# EAGLE design deflection_amplifier (EAGLE 9.6.2)
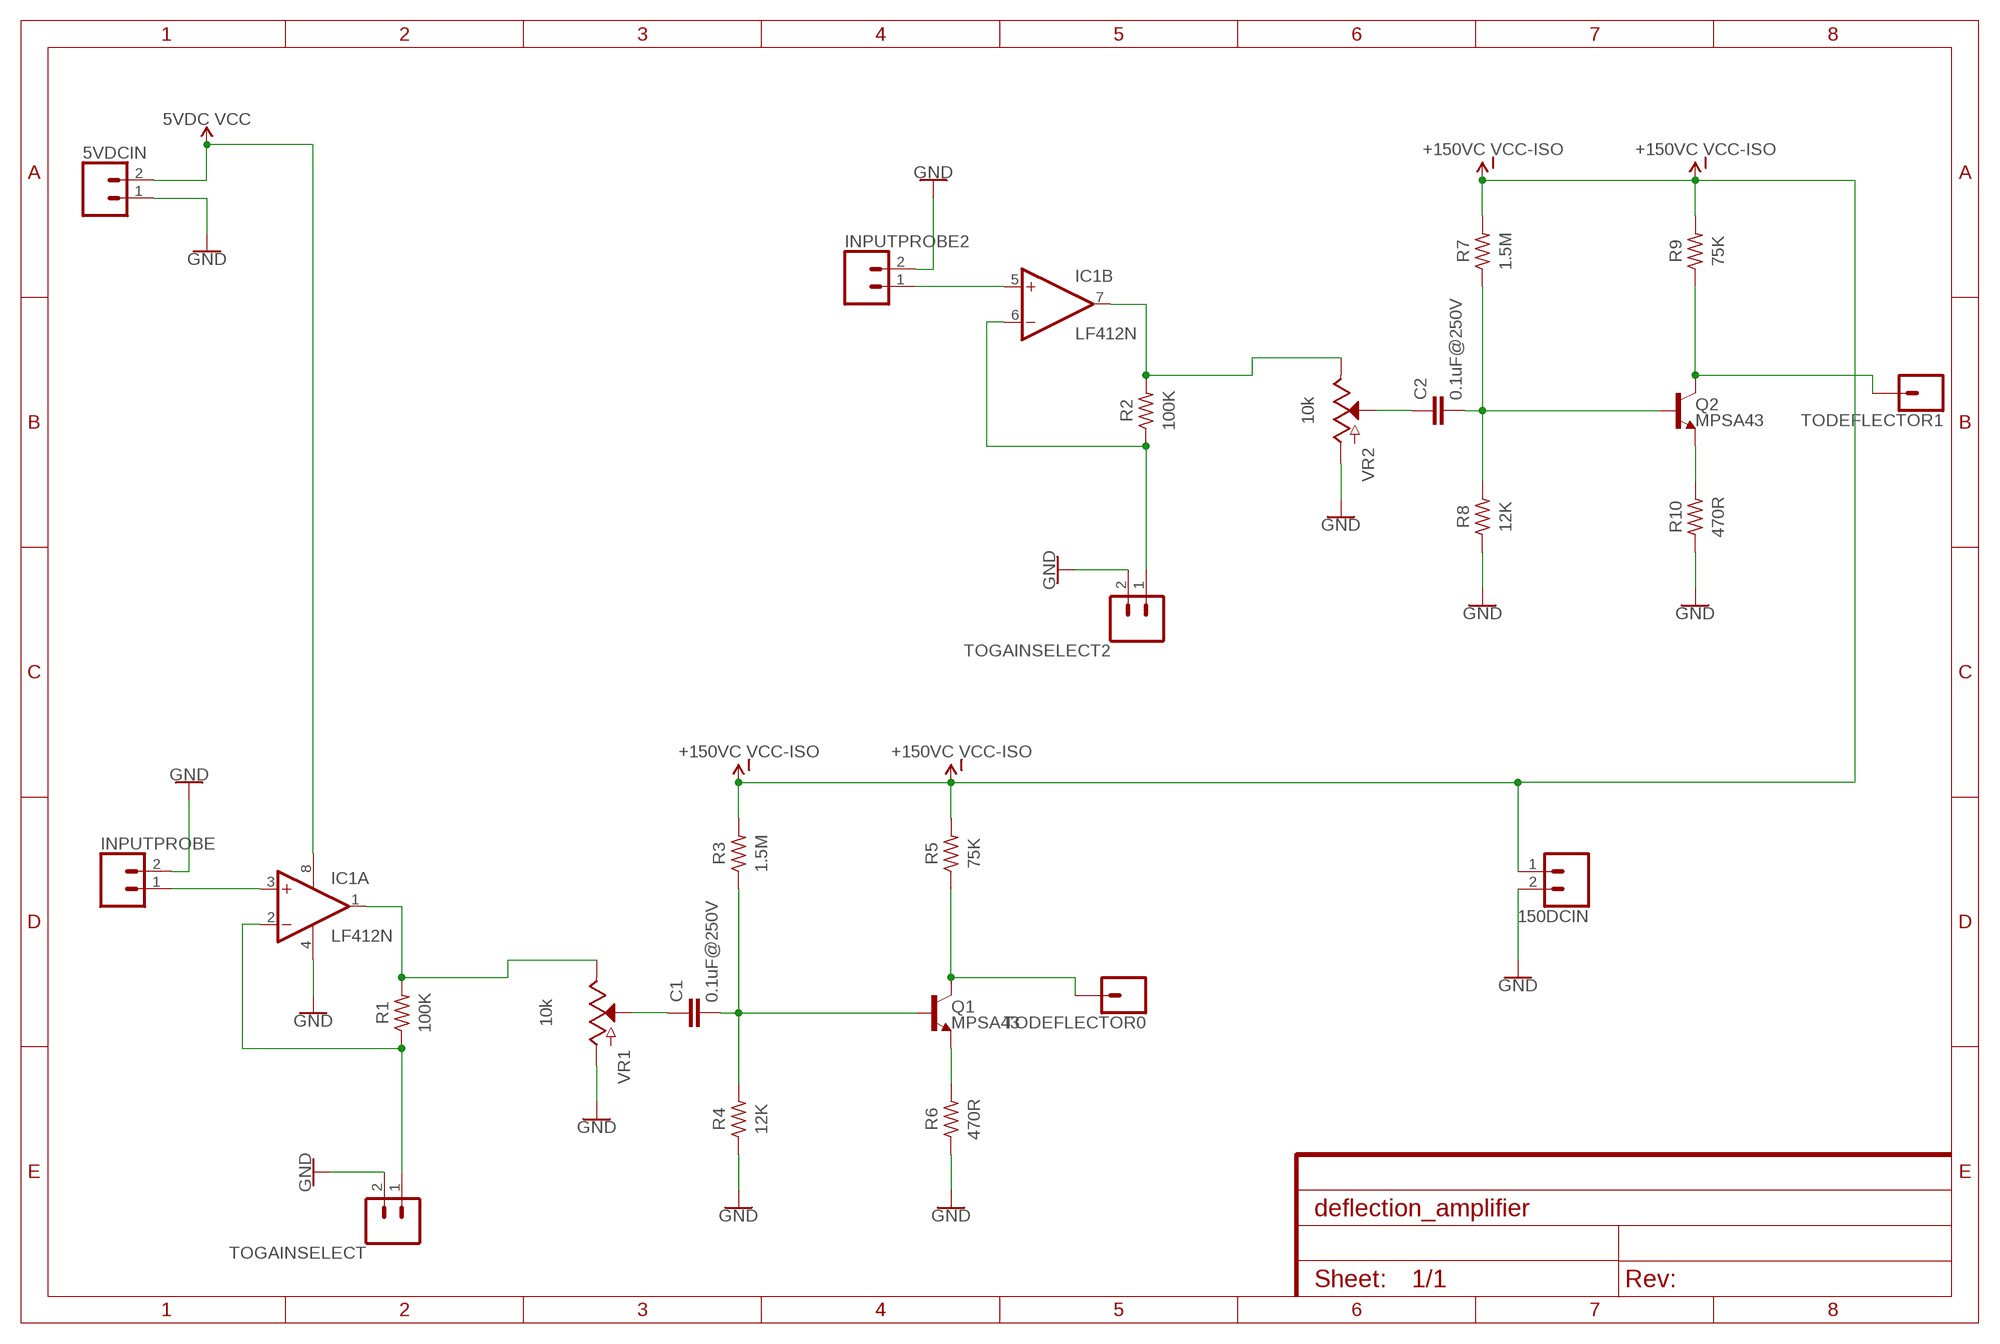
[diagram p0: schematic, sheet 1]

## Parts
5VDCIN  CONN_02  [1X02]
150DCIN  CONN_02  [1X02]
C1  0.1uF@250V  C15/8  [C15B8]
C2  0.1uF@250V  C15/8  [C15B8]
IC1  LF412N  [DIL08]
INPUTPROBE  CONN_02  [1X02]
INPUTPROBE2  CONN_02  [1X02]
Q1  MPSA43  TRANS_NPN-2N3904  [TO-92]
Q2  MPSA43  TRANS_NPN-2N3904  [TO-92]
R1  100K  R-US_AXIAL-11.7MM-PITCH  [RESAD1176W63L850D250B]
R2  100K  R-US_AXIAL-11.7MM-PITCH  [RESAD1176W63L850D250B]
R3  1.5M  R-US_AXIAL-11.7MM-PITCH  [RESAD1176W63L850D250B]
R4  12K  R-US_AXIAL-11.7MM-PITCH  [RESAD1176W63L850D250B]
R5  75K  R-US_AXIAL-11.7MM-PITCH  [RESAD1176W63L850D250B]
R6  470R  R-US_AXIAL-11.7MM-PITCH  [RESAD1176W63L850D250B]
R7  1.5M  R-US_AXIAL-11.7MM-PITCH  [RESAD1176W63L850D250B]
R8  12K  R-US_AXIAL-11.7MM-PITCH  [RESAD1176W63L850D250B]
R9  75K  R-US_AXIAL-11.7MM-PITCH  [RESAD1176W63L850D250B]
R10  470R  R-US_AXIAL-11.7MM-PITCH  [RESAD1176W63L850D250B]
TODEFLECTOR0  CONN_01  [1X01]
TODEFLECTOR1  CONN_01  [1X01]
TOGAINSELECT  CONN_02  [1X02]
TOGAINSELECT2  CONN_02  [1X02]
VR1  10k  POTENTIOMETER-PTH-9MM-1/20W-20%  [POT-PTH-ALPS]
VR2  10k  POTENTIOMETER-PTH-9MM-1/20W-20%  [POT-PTH-ALPS]

## Nets
GND: 5VDCIN.1 150DCIN.2 IC1.4(P:V-) INPUTPROBE2.2 INPUTPROBE.2 R4.1 R6.1 R8.1 R10.1 TOGAINSELECT2.2 TOGAINSELECT.2 VR1.P$3(A) VR2.P$3(A)
N$1: IC1.1(A:OUT) R1.2 VR1.P$1(E)
N$2: IC1.2(A:-IN) R1.1 TOGAINSELECT.1
N$3: IC1.3(A:+IN) INPUTPROBE.1
N$4: C1.1 VR1.P$2(S)
N$5: C1.2 Q1.2(B) R3.1 R4.2
N$6: Q1.1(E) R6.2
N$7: Q1.3(C) R5.1 TODEFLECTOR0.1
N$8: IC1.7(B:OUT) R2.2 VR2.P$1(E)
N$9: IC1.6(B:-IN) R2.1 TOGAINSELECT2.1
N$10: IC1.5(B:+IN) INPUTPROBE2.1
N$11: C2.1 VR2.P$2(S)
N$12: C2.2 Q2.2(B) R7.1 R8.2
N$13: Q2.1(E) R10.2
N$14: Q2.3(C) R9.1 TODEFLECTOR1.1
VCC: 5VDCIN.2 IC1.8(P:V+) ; supply symbol labelled 5VDC VCC
VCC-ISO: 150DCIN.1 R3.2 R5.2 R7.2 R9.2 ; supply symbol labelled +150VC VCC-ISO

## Library data of the parts
5VDCIN 150DCIN INPUTPROBE INPUTPROBE2 TOGAINSELECT TOGAINSELECT2 = SparkFun-Connectors:CONN_02: Multi connection point. Often used as Generic Header-pin footprint for 0.1 inch spaced/style header connections On any of the 0.1 inch spaced packages, you can populate with these: Break Away Headers - Straight <https://www.sparkfun.com/products/116> (PRT-00116) Break Away Male Headers - Right Angle <https://www.sparkfun.com/products/553> (PRT-00553) Female Headers <https://www.sparkfun.com/products/115> (PRT-00115) Break Away Headers - Machine Pin <https://www.sparkfun.com/products/117> (PRT-00117) Break Away Female Headers - Swiss Machine Pin <https://www.sparkfun.com/products/743> (PRT-00743) For SCREWTERMINALS and SPRING TERMINALS visit here: Screw Terimnals on SparkFun.com <https://www.sparkfun.com/search/results?term=Screw+Terminals> (5mm/3.5mm/2.54mm spacing) This device is also useful as a general connection point to wire up your design to another part of your project. Our various solder wires solder well into these plated through hole pads. Hook-Up Wire - Assortment (Stranded, 22 AWG) <https://www.sparkfun.com/products/11375> (PRT-11375) Hook-Up Wire - Assortment (Solid Core, 22 AWG) <https://www.sparkfun.com/products/11367> (PRT-11367) View the entire wire category on our website here <https://www.sparkfun.com/categories/141> Special notes: Molex polarized connector foot print use with: PRT-08233 with associated crimp pins and housings. 2.54_SCREWTERM for use with PRT-10571. 3.5mm Screw Terminal footprints for PRT-08084 5mm Screw Terminal footprints for use with PRT-08432
C1 C2 = capacitor-wima:C: CAPACITOR naming: grid - package width
IC1 = linear:LF412: OP AMP
Q1 Q2 = SparkFun-DiscreteSemi:TRANS_NPN: NPN transistor Current controlled devices typically used to amplify current or used as a switch. BC547 - COM-08928 <http://www.sparkfun.com/products/8928> (TO-92 45V 100mA) (1.Collector 2.Base 3.Emitter) 2N3904 - COM-00521 <http://www.sparkfun.com/products/521> (TO-92 40V 200mA) (1.Emitter 2.Base 3.Collector) P2N2222A - COM-12852 <http://www.sparkfun.com/products/12852> (TO-92 40V 600mA) (1.Collector 2.Base 3.Emitter); PROD_ID: TRANS-08447; VALUE: 200mA/40V
R1-R10 = Resistor:R-US: Resistor Fixed - ANSI; CATEGORY: Resistor; SUB-CATEGORY: Fixed
TODEFLECTOR0 TODEFLECTOR1 = SparkFun-Connectors:CONN_01: Single connection point. Often used as Generic Header-pin footprint for 0.1 inch spaced/style header connections On any of the 0.1 inch spaced packages, you can populate with these: Break Away Headers - Straight <https://www.sparkfun.com/products/116> (PRT-00116) Break Away Male Headers - Right Angle <https://www.sparkfun.com/products/553> (PRT-00553) Female Headers <https://www.sparkfun.com/products/115> (PRT-00115) Break Away Headers - Machine Pin <https://www.sparkfun.com/products/117> (PRT-00117) Break Away Female Headers - Swiss Machine Pin <https://www.sparkfun.com/products/743> (PRT-00743) This device is also useful as a general connection point to wire up your design to another part of your project. Our various solder wires solder well into these plated through hole pads. Hook-Up Wire - Assortment (Stranded, 22 AWG) <https://www.sparkfun.com/products/11375> (PRT-11375) Hook-Up Wire - Assortment (Solid Core, 22 AWG) <https://www.sparkfun.com/products/11367> (PRT-11367) View the entire wire category on our website here <https://www.sparkfun.com/categories/141> Special notes: SMTSO-256-ET is a "flush mount" nut for a 4-40 screw. We mostly use this on specialty testbeds; it is a nice way to connect hardware to your PCB at an adjustable hieght. Also note, the SNAP packages are for using a snappable style connector. We sell a baggie of snaps and they are also used on two LilyPad designs: Snap Assortment - 30 pack (male and female) <https://www.sparkfun.com/products/11347> (DEV-11347) LilyPad Arduino SimpleSnap <https://www.sparkfun.com/products/10941> (DEV-10941) LilyPad SimpleSnap Protoboard <https://www.sparkfun.com/products/10940> (DEV-10940)
VR1 VR2 = SparkFun-Resistors:POTENTIOMETER: Potentiometer (Pot) Three-terminal potentiometers, with an adjustable wiper and two adjustable resistors. A pot can be used to create a configurable voltage divider, or as a variable resistor. Variants ALPS_POT and ALPS_POT_KIT - PTH, breadboard compatible, 9mm square pots Rotary Potentiometer - Linear (10k ohm) <https://www.sparkfun.com/products/9288> (COM-09288) The KIT variant exposes copper on only one side of the PTH pad, so the part can only be assembled on one side of the PCB. Useful for beginner soldering kits.; PROD_ID: RES-09177; SF_SKU: COM-09288

## Board
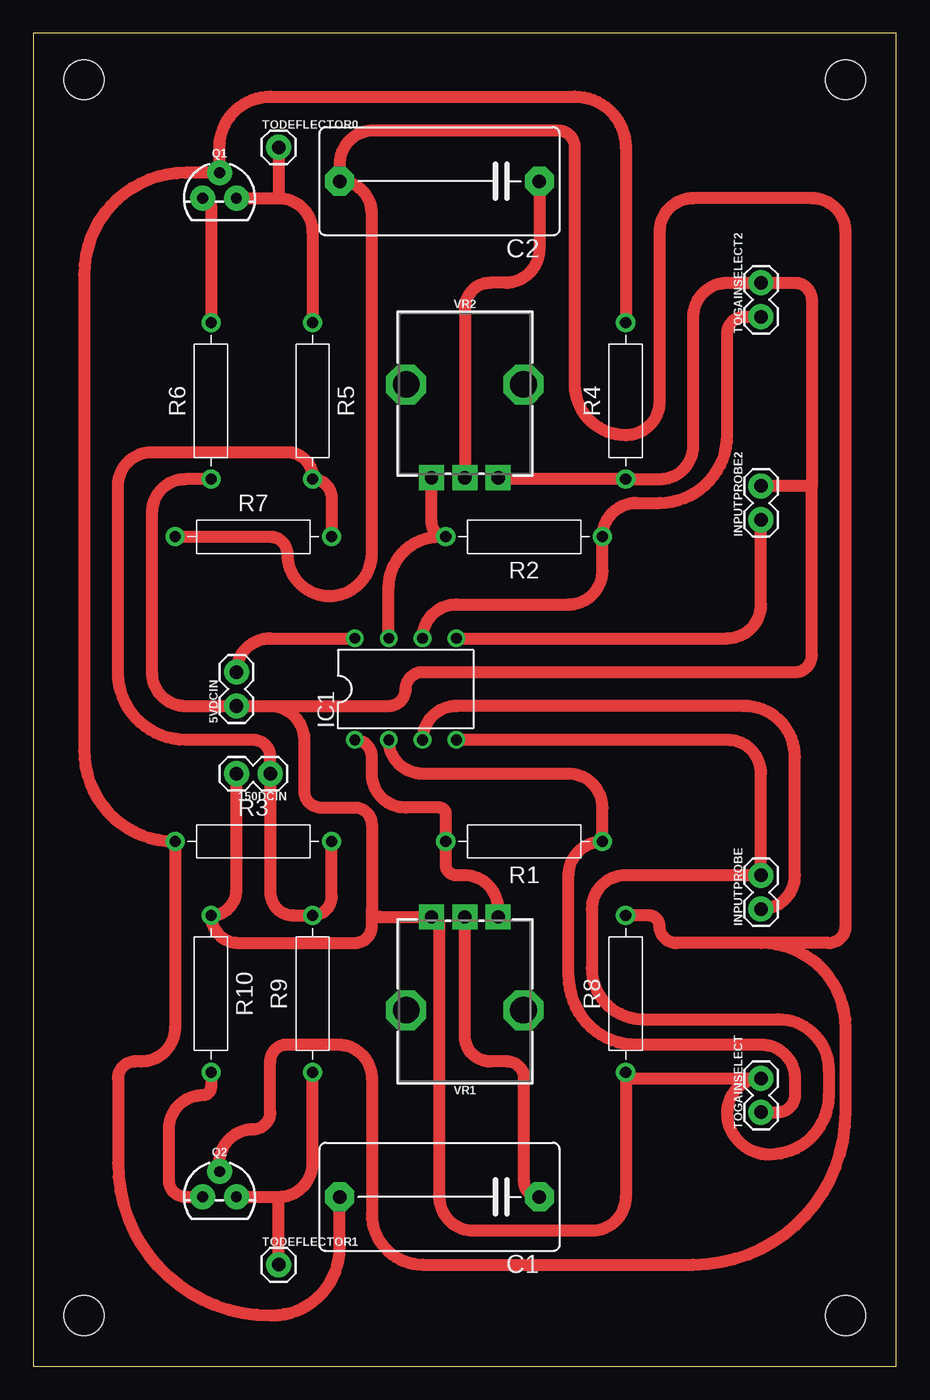
[diagram p1: board, top side]

Size 64.75 x 100 mm. Coordinates in mm from the lower left corner, seen from the top.
Outline: 0,0 64.75,0 64.75,100 0,100 0,0
Copper layers (1*16): Top 0.035mm / dielectric 1.5mm / Bottom 0.035mm
Design rules "default": minimum track width 6mil, minimum drill 0.35mm, track to track 6mil, track to pad 6mil, pad to pad 6mil, via to via 6mil, smd to smd 6mil, copper to edge 40mil, drill to drill 6mil, minimum pad ring 10mil, minimum via ring 8mil, stop-mask expansion 4mil, vias tented up to drill 0mil, thermal gap 10mil
Holes 3 mm at 60.96,96.52 3.81,96.52 60.96,3.81 3.81,3.81

### Footprints (pad centres in the part's own frame; a part is rotated, then mirrored left to right if it is on the bottom)
1X02 = drill 1.016 pad 1.88: 1 0,0; 2 2.54,0
C15B8 = drill 1.016 pad 2.159 octagon: 1 -7.493,0; 2 7.493,0
DIL08 = drill 0.813 pad 1.27: 1 -3.81,-3.81; 2 -1.27,-3.81; 3 1.27,-3.81; 4 3.81,-3.81; 5 3.81,3.81; 6 1.27,3.81; 7 -1.27,3.81; 8 -3.81,3.81
TO-92 = drill 0.813 pad 1.88: 1 -1.27,0; 2 0,1.905; 3 1.27,0
RESAD1176W63L850D250B = drill 0.83 pad 1.43: 1 -5.88,0; 2 5.88,0
1X01 = drill 1.016 pad 1.88: 1 0,0
POT-PTH-ALPS = drill 1 pad 1.88 square: P$1 7,-2.5; P$2 7,0; P$3 7,2.5 | drill 2 octagon: P$4 0,-4.4; P$5 0,4.4

### Placement (x,y rotation side)
5VDCIN  15.24,49.53 90 top
150DCIN  17.78,44.45 180 top
C1  30.48,12.7 180 top
C2  30.48,88.9 180 top
IC1  27.94,50.8 0 top
INPUTPROBE  54.61,34.29 90 top
INPUTPROBE2  54.61,63.5 90 top
Q1  13.97,87.63 0 top
Q2  13.97,12.7 0 top
R1  36.83,39.37 180 top
R2  36.83,62.23 180 top
R3  16.51,39.37 0 top
R4  44.45,72.43 90 top
R5  20.95,72.43 270 top
R6  13.34,72.43 90 top
R7  16.51,62.23 0 top
R8  44.45,27.94 90 top
R9  20.95,27.94 90 top
R10  13.34,27.94 270 top
TODEFLECTOR0  18.41,91.44 0 top
TODEFLECTOR1  18.41,7.62 0 top
TOGAINSELECT  54.61,19.05 90 top
TOGAINSELECT2  54.61,78.74 90 top
VR1  32.38,26.71 90 top
VR2  32.38,73.66 270 top

### Tracks (layer width: path | path; a pad name or v marks a point on that pad's centre or on a via)
GND
  Top 0.889: 150DCIN.2 15.24,35.73 arc-90 R10.1 arc90 15.4,31.75 24.13,31.75 arc90 25.4,33.02 25.4,34.29 | IC1.4 52.07,46.99 arc-90 54.61,44.45 INPUTPROBE.2 44.45,36.83 arc90 41.91,34.29 41.91,29.84 arc90 45.72,26.04 55.88,26.04 arc-90 59.69,22.23 59.69,20.32 arc-90 55.24,15.88 arc-90 52.07,19.05 arc-90 TOGAINSELECT.2 44.92,21.59 arc-90 R8.1 44.45,12.7 arc-90 41.91,10.16 33.02,10.16 arc-90 30.48,12.7 30.48,33.11 arc90 VR1.P$3 25.98,33.71 arc-90 25.4,34.29 | 17.78,49.53 5VDCIN.1 11.43,49.53 arc-90 8.89,52.07 8.89,64.01 arc-90 11.43,66.55 R6.1 | 17.78,49.53 arc-90 20.32,46.99 20.32,43.18 arc90 21.59,41.91 24.13,41.91 arc-90 25.4,40.64 25.4,34.29 | 17.78,49.53 26.67,49.53 arc90 27.94,50.8 arc-90 29.21,52.07 57.15,52.07 arc90 58.42,53.34 58.42,66.04 | 58.42,66.04 INPUTPROBE2.2 | 58.42,66.04 58.42,80.01 arc90 57.15,81.28 TOGAINSELECT2.2 52.07,81.28 arc90 49.53,78.74 49.53,69.09 arc-90 46.99,66.55 R4.1 35,66.55 arc-90 VR2.P$3
N$1
  Top 0.889: VR1.P$1 34.88,34.29 arc90 32.34,36.83 31.75,36.83 arc-90 30.95,37.63 R1.2 30.95,41.44 arc90 30.48,41.91 27.94,41.91 arc-90 25.4,44.45 25.4,45.72 arc90 IC1.1
N$2
  Top 0.889: TOGAINSELECT.1 55.88,19.05 arc90 57.15,20.32 57.15,21.59 arc90 54.61,24.13 45.25,24.13 arc-90 40.17,29.21 40.17,36.83 arc-90 R1.1 42.71,41.91 arc90 40.17,44.45 29.21,44.45 arc-90 IC1.2
N$3
  Top 0.889: INPUTPROBE.1 arc90 57.15,36.83 57.15,45.72 arc90 53.34,49.53 31.75,49.53 arc90 IC1.3
N$4
  Top 0.889: C1.1 arc-90 36.83,13.84 36.83,21.59 arc90 35.56,22.86 34.29,22.86 arc-90 32.38,24.77 VR1.P$2
N$5
  Top 0.889: R4.2 44.45,91.44 arc90 40.64,95.25 17.78,95.25 arc90 13.97,91.44 Q1.2 11.43,89.53 arc90 3.81,81.92 3.81,46.19 arc90 R3.1 10.63,25.4 arc-90 8.09,22.86 7.62,22.86 arc90 6.35,21.59 6.35,15.24 arc90 17.78,3.81 17.91,3.81 arc90 22.99,8.89 C1.2
N$6
  Top 0.889: Q1.1 arc-90 13.34,87 R6.2
N$7
  Top 0.889: Q1.3 18.41,87.63 | 18.41,87.63 arc-90 20.95,85.09 R5.1 | TODEFLECTOR0.1 18.41,87.63
N$8
  Top 0.889: VR2.P$1 29.89,63.3 arc90 R2.2 30.48,62.23 arc90 26.67,58.42 IC1.7
N$9
  Top 0.889: IC1.6 arc-90 31.75,57.15 40.17,57.15 arc90 42.71,59.69 R2.1 arc-90 45.25,64.77 46.99,64.77 arc90 52.07,69.85 52.07,77.47 arc-90 53.34,78.74 TOGAINSELECT2.1
N$10
  Top 0.889: IC1.5 52.07,54.61 arc90 54.61,57.15 INPUTPROBE2.1
N$11
  Top 0.889: C2.1 37.97,83.82 arc-90 35.43,81.28 34.29,81.28 arc90 32.38,79.38 VR2.P$2
N$12
  Top 0.889: 54.61,31.75 arc-90 60.96,25.4 60.96,19.05 arc-90 49.53,7.62 29.21,7.62 arc-90 25.4,11.43 25.4,21.59 arc90 22.86,24.13 19.05,24.13 arc90 17.78,22.86 17.78,19.05 arc-90 16.51,17.78 arc90 13.97,15.24 Q2.2 | 54.61,31.75 48.26,31.75 arc-90 46.99,33.02 arc90 46.19,33.82 R8.2 | 54.61,31.75 59.69,31.75 arc90 60.96,33.02 60.96,85.09 arc90 58.42,87.63 49.53,87.63 arc90 46.99,85.09 46.99,72.39 arc-90 44.45,69.85 arc-90 40.64,73.66 40.64,91.44 arc90 39.37,92.71 25.53,92.71 arc90 22.99,90.17 C2.2 arc-90 25.4,86.49 25.4,60.96 arc-90 22.23,57.78 arc-90 19.05,60.96 arc90 17.78,62.23 R7.1
N$13
  Top 0.889: R10.2 13.34,20.95 arc-90 12.7,20.32 arc90 10.16,17.78 10.16,13.97 arc90 11.43,12.7 Q2.1
N$14
  Top 0.889: 18.41,12.7 arc90 20.95,15.24 R9.1 | Q2.3 18.41,12.7 | TODEFLECTOR1.1 18.41,12.7
VCC
  Top 0.889: 5VDCIN.2 arc-90 17.78,54.61 IC1.8
VCC-ISO
  Top 0.889: R3.2 22.39,35.26 arc-90 R9.2 19.52,33.82 arc-90 17.78,35.56 150DCIN.1 17.78,45.72 arc90 16.51,46.99 11.43,46.99 arc-90 6.35,52.07 6.35,66.04 arc-90 8.89,68.58 19.05,68.58 arc-90 20.95,66.67 R5.2 arc-90 22.39,65.11 R7.2